# Altium schematic sheet Knee Comp Clipper.SchDoc
size Letter; SheetNumber: 6; SheetTotal: 14
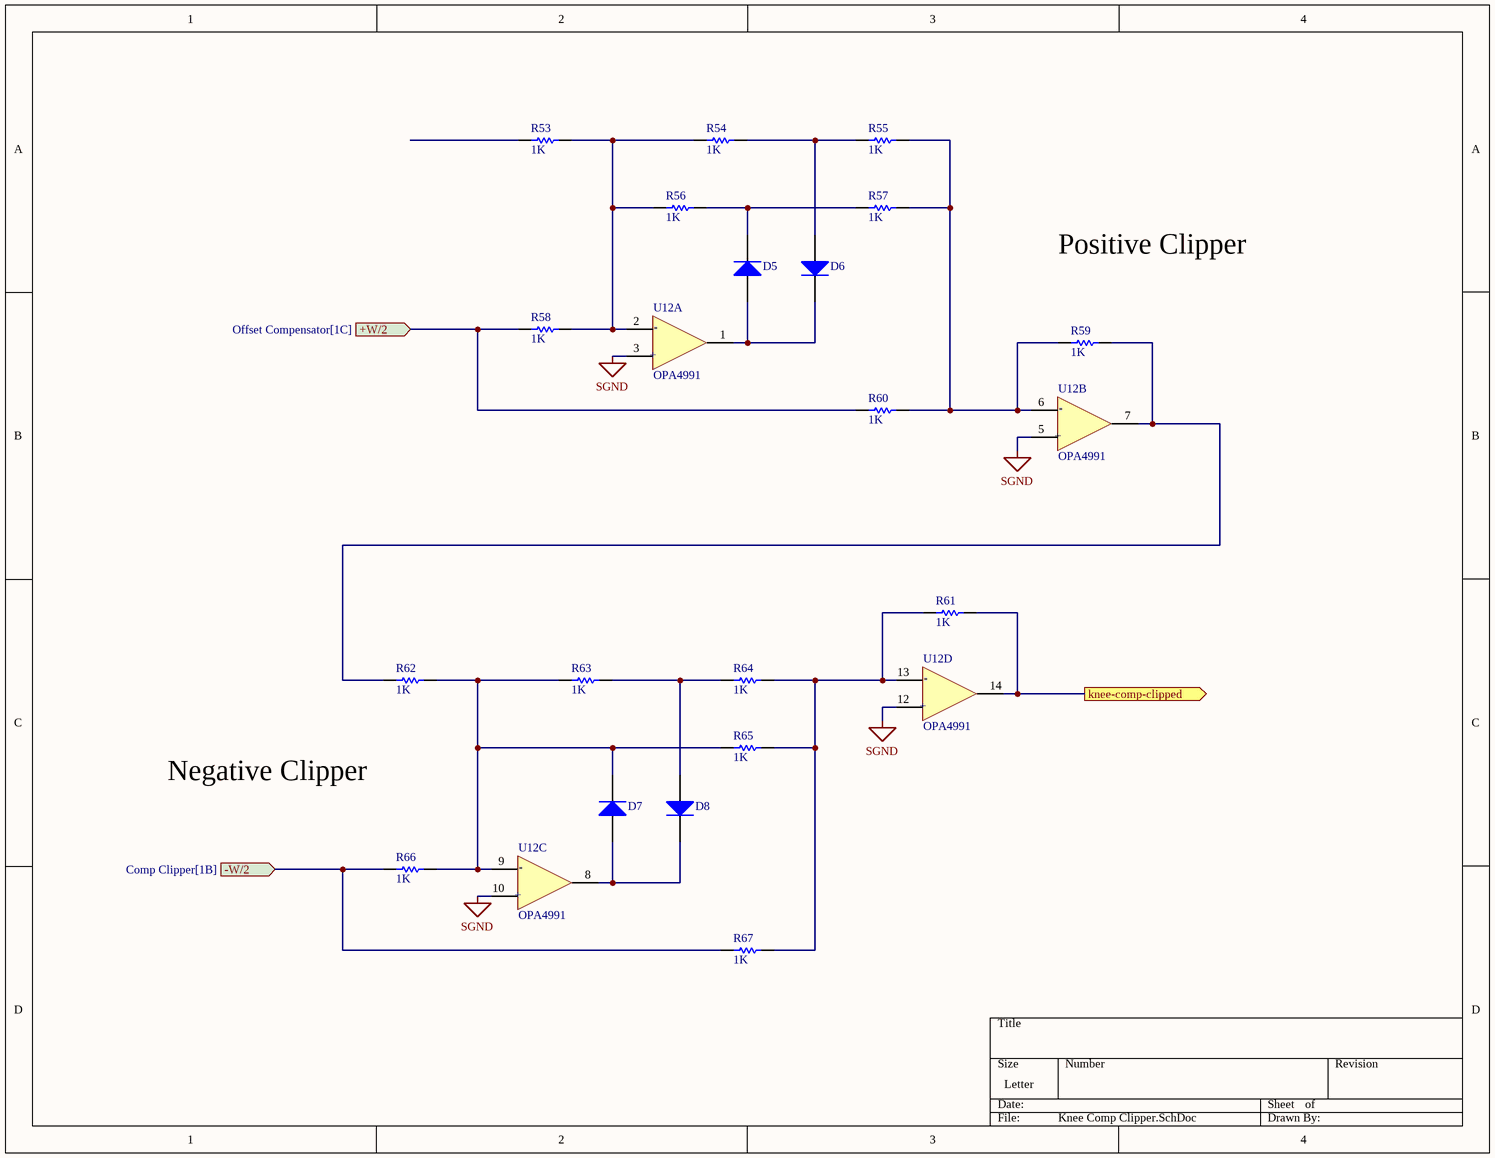
[diagram p0: Knee Comp Clipper.SchDoc]

## Parts
D5  Diode  (value not drawn)
D6  Diode  (value not drawn)
D7  Diode  (value not drawn)
D8  Diode  (value not drawn)
R53  value 1K  (hidden comment: Resistor)
R54  value 1K  (hidden comment: Resistor)
R55  value 1K  (hidden comment: Resistor)
R56  value 1K  (hidden comment: Resistor)
R57  value 1K  (hidden comment: Resistor)
R58  value 1K  (hidden comment: Resistor)
R59  value 1K  (hidden comment: Resistor)
R60  value 1K  (hidden comment: Resistor)
R61  value 1K  (hidden comment: Resistor)
R62  value 1K  (hidden comment: Resistor)
R63  value 1K  (hidden comment: Resistor)
R64  value 1K  (hidden comment: Resistor)
R65  value 1K  (hidden comment: Resistor)
R66  value 1K  (hidden comment: Resistor)
R67  value 1K  (hidden comment: Resistor)
U12  OPA4991  [FP-D0014A-IPC_B]  (parts A,B,C,D of 5)

## Ports
+W/2 (in, see Offset Compensator[1C]), -W/2 (in, see Comp Clipper[1B]), knee-comp-clipped (out)

## Nets
SGND: U12.3(IN1+) U12.5(IN2+) U12.10(IN3+) U12.12(IN4+)
+W/2: R58.1 R60.1 ; port +W/2
-W/2: R66.1 R67.1 ; port -W/2
knee-comp-clipped: R61.2 U12.14(OUT4) ; port knee-comp-clipped
NetD5_1: D5.1(A) D6.2(K) U12.1(OUT1)
NetD5_2: D5.2(K) R56.2 R57.1
NetD6_1: D6.1(A) R54.2 R55.1
NetD7_1: D7.1(A) D8.2(K) U12.8(OUT3)
NetD7_2: D7.2(K) R62.2 R63.1 R65.1 R66.2 U12.9(IN3-)
NetD8_1: D8.1(A) R63.2 R64.1
NetR53_2: R53.2 R54.1 R56.1 R58.2 U12.2(IN1-)
NetR55_2: R55.2 R57.2 R59.1 R60.2 U12.6(IN2-)
NetR59_2: R59.2 R62.1 U12.7(OUT2)
NetR61_1: R61.1 R64.2 R65.2 R67.2 U12.13(IN4-)

Not connected (* = marked no-connect by the designer): R53 1

## Notes on the sheet
- Positive Clipper
- Negative Clipper
- (in symbol OPA4991IDR, part A) -; +
- (in symbol OPA4991IDR, part B) -; +
- (in symbol OPA4991IDR, part C) -; +
- (in symbol OPA4991IDR, part D) -; +

## Library data of the parts
D5-D8 = Diode: AF: 1; BV: 0; BV_MAX: 1e99; EG: 1.11; FC: 0.5; IBV: 0.001; ISR: 1e-14; MJSW: 0.33; NTUN: 30; TNOM: 27; XTI: 3; SimulationGenericComponent: True; CJO: 0; CJP: 0; CTA: 0; CTP: 0; FCS: 0.5; FV_MAX: 1e99; IKF: 0; IKR: 0; JSW: 0; JTUN: 0; JTUNSW: 0; KEG: 1; KF: 0; LEVEL: 1; N: 1; NBV: 1; NR: 1; NS: 1; PHP: 1; RS: 0; TCV: 0; TLEV: 0; TLEVC: 0; TM1: 0; TM2: 0; TPB: 0; TPHP: 0; TRS: 0; TRS2: 0; TT: 0; TTT1: 0; TTT2: 0; VJ: 1; XTITUN: 3; IS: 1e-14
R53-R67 = Resistor: TC1: 0; SimulationGenericComponent: True; TC2: 0
U12 = OPA4991IDR: 40-V, DUAL 4.5MHZ, RAIL-TO-RAIL